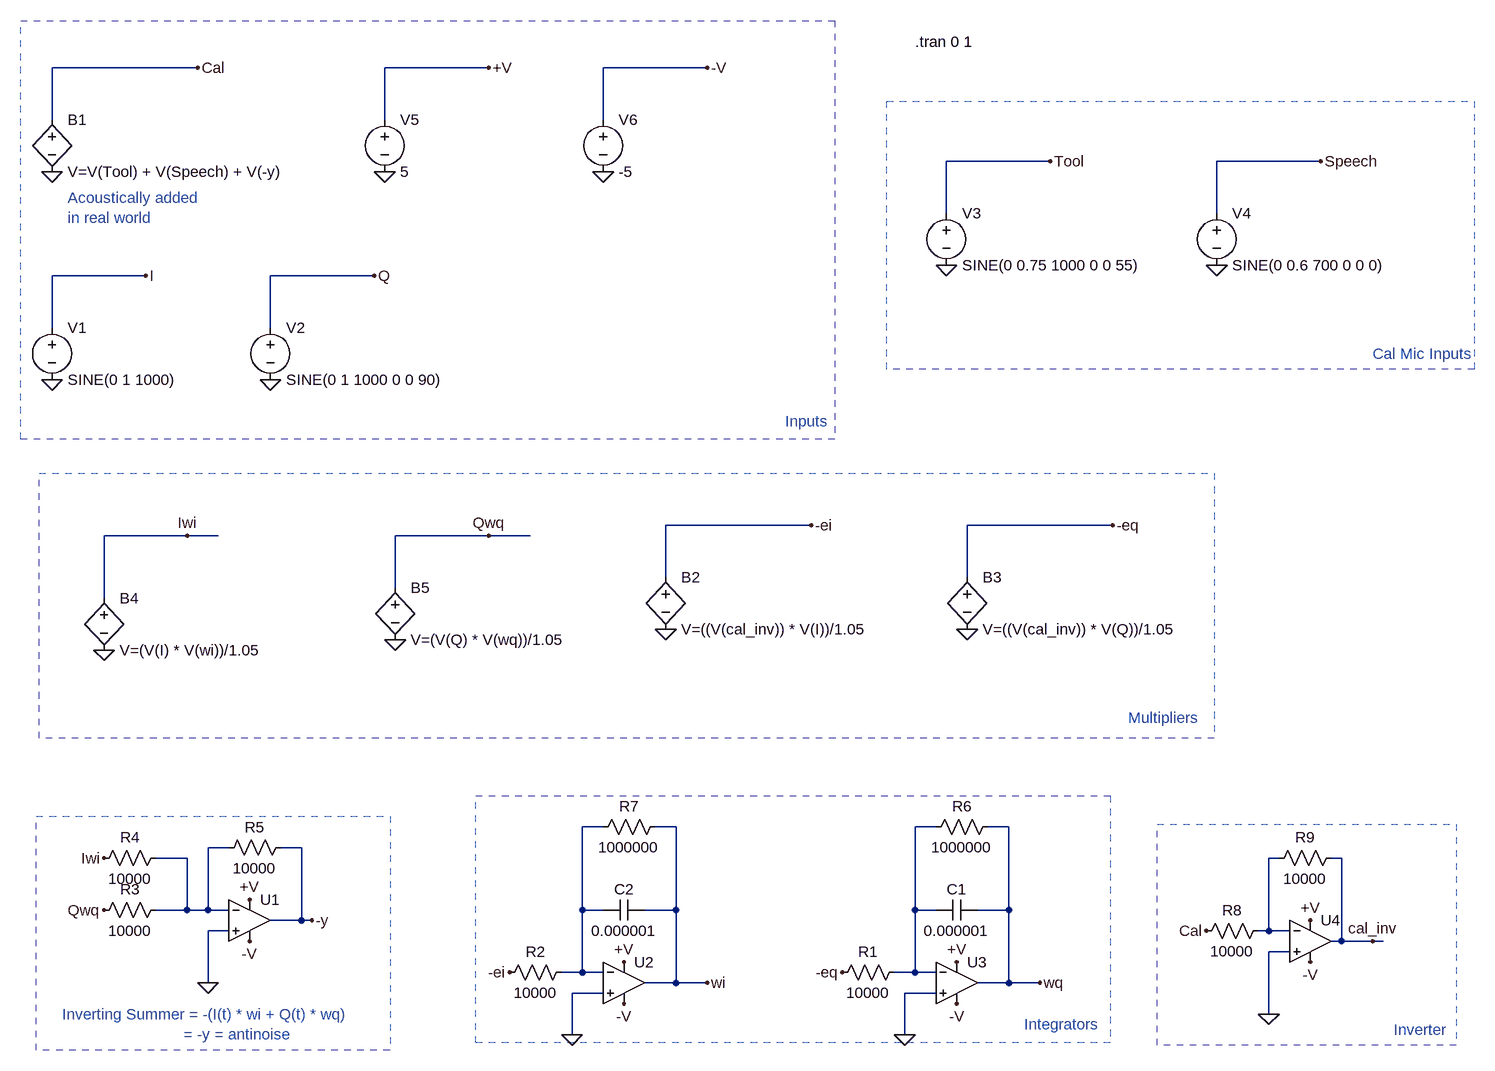
[diagram p0: schematic ancsim.asc]
ancsim.asc, the LTspice schematic file:
Version 4
SHEET 1 3376 1148
WIRE 624 -368 400 -368
WIRE 1072 -368 912 -368
WIRE 1408 -368 1248 -368
WIRE 400 -288 400 -368
WIRE 912 -288 912 -368
WIRE 1248 -288 1248 -368
WIRE 1936 -224 1776 -224
WIRE 2352 -224 2192 -224
WIRE 1776 -144 1776 -224
WIRE 2192 -144 2192 -224
WIRE 544 -48 400 -48
WIRE 896 -48 736 -48
WIRE 400 32 400 -48
WIRE 736 32 736 -48
WIRE 1568 336 1344 336
WIRE 2032 336 1808 336
WIRE 608 352 480 352
WIRE 656 352 608 352
WIRE 1072 352 928 352
WIRE 1136 352 1072 352
WIRE 1344 416 1344 336
WIRE 1808 416 1808 336
WIRE 928 432 928 352
WIRE 480 448 480 352
WIRE 1248 800 1216 800
WIRE 1360 800 1328 800
WIRE 1760 800 1728 800
WIRE 1872 800 1840 800
WIRE 672 832 640 832
WIRE 784 832 752 832
WIRE 608 848 560 848
WIRE 2288 848 2272 848
WIRE 2384 848 2368 848
WIRE 608 928 608 848
WIRE 608 928 560 928
WIRE 640 928 640 832
WIRE 640 928 608 928
WIRE 672 928 640 928
WIRE 1216 928 1216 800
WIRE 1248 928 1216 928
WIRE 1360 928 1360 800
WIRE 1360 928 1312 928
WIRE 1728 928 1728 800
WIRE 1760 928 1728 928
WIRE 1872 928 1872 800
WIRE 1872 928 1824 928
WIRE 784 944 784 832
WIRE 784 944 736 944
WIRE 800 944 784 944
WIRE 672 960 640 960
WIRE 2272 960 2272 848
WIRE 2272 960 2256 960
WIRE 2304 960 2272 960
WIRE 2384 976 2384 848
WIRE 2384 976 2368 976
WIRE 2432 976 2384 976
WIRE 2448 976 2432 976
WIRE 2304 992 2272 992
WIRE 1216 1024 1216 928
WIRE 1216 1024 1184 1024
WIRE 1248 1024 1216 1024
WIRE 1728 1024 1728 928
WIRE 1728 1024 1696 1024
WIRE 1760 1024 1728 1024
WIRE 640 1040 640 960
WIRE 1360 1040 1360 928
WIRE 1360 1040 1312 1040
WIRE 1408 1040 1360 1040
WIRE 1872 1040 1872 928
WIRE 1872 1040 1824 1040
WIRE 1920 1040 1872 1040
WIRE 1248 1056 1200 1056
WIRE 1760 1056 1712 1056
WIRE 2272 1088 2272 992
WIRE 1200 1120 1200 1056
WIRE 1712 1120 1712 1056
FLAG 400 112 0
FLAG 736 112 0
FLAG 1776 -64 0
FLAG 2192 -64 0
FLAG 544 -48 I
FLAG 896 -48 Q
FLAG 1936 -224 Tool
FLAG 2352 -224 Speech
FLAG 400 -208 0
FLAG 624 -368 Cal
FLAG 1344 496 0
FLAG 1808 496 0
FLAG 1568 336 -ei
FLAG 2032 336 -eq
FLAG 1712 1120 0
FLAG 1920 1040 wq
FLAG 1200 1120 0
FLAG 1408 1040 wi
FLAG 912 -208 0
FLAG 1072 -368 +V
FLAG 1248 -208 0
FLAG 1408 -368 -V
FLAG 704 912 +V
FLAG 1280 1008 +V
FLAG 1792 1008 +V
FLAG 1792 1072 -V
FLAG 1280 1072 -V
FLAG 704 976 -V
FLAG 480 528 0
FLAG 928 512 0
FLAG 608 352 Iwi
FLAG 1072 352 Qwq
FLAG 480 848 Iwi
FLAG 480 928 Qwq
FLAG 800 944 -y
FLAG 640 1040 0
FLAG 1104 1024 -ei
FLAG 1616 1024 -eq
FLAG 2272 1088 0
FLAG 2176 960 Cal
FLAG 2432 976 cal_inv
FLAG 2336 944 +V
FLAG 2336 1008 -V
SYMBOL voltage 400 16 R0
SYMATTR InstName V1
SYMATTR Value SINE(0 1 1000)
SYMBOL voltage 736 16 R0
SYMATTR InstName V2
SYMATTR Value SINE(0 1 1000 0 0 90)
SYMBOL voltage 1776 -160 R0
SYMATTR InstName V3
SYMATTR Value SINE(0 0.75 1000 0 0 55)
SYMBOL voltage 2192 -160 R0
SYMATTR InstName V4
SYMATTR Value SINE(0 0.6 700 0 0 0)
SYMBOL bv 400 -304 R0
SYMATTR InstName B1
SYMATTR Value V=V(Tool) + V(Speech) + V(-y)
SYMBOL OpAmps/UniversalOpAmp2 704 944 R0
SYMATTR InstName U1
SYMATTR Value2 Avol=1Meg GBW=10Meg Slew=20Meg
SYMBOL OpAmps/UniversalOpAmp2 1792 1040 R0
SYMATTR InstName U3
SYMBOL bv 1344 400 R0
SYMATTR InstName B2
SYMATTR Value V=((V(cal_inv)) * V(I))/1.05
SYMBOL bv 1808 400 R0
SYMATTR InstName B3
SYMATTR Value V=((V(cal_inv)) * V(Q))/1.05
SYMBOL Res 1712 1008 R90
WINDOW 0 0 56 VBottom 2
WINDOW 3 32 56 VTop 2
SYMATTR InstName R1
SYMATTR Value 10000
SYMBOL Cap 1824 912 R90
WINDOW 0 0 32 VBottom 2
WINDOW 3 32 32 VTop 2
SYMATTR InstName C1
SYMATTR Value 0.000001
SYMBOL OpAmps/UniversalOpAmp2 1280 1040 R0
SYMATTR InstName U2
SYMBOL Res 1200 1008 R90
WINDOW 0 0 56 VBottom 2
WINDOW 3 32 56 VTop 2
SYMATTR InstName R2
SYMATTR Value 10000
SYMBOL Cap 1312 912 R90
WINDOW 0 0 32 VBottom 2
WINDOW 3 32 32 VTop 2
SYMATTR InstName C2
SYMATTR Value 0.000001
SYMBOL voltage 912 -304 R0
SYMATTR InstName V5
SYMATTR Value 5
SYMBOL voltage 1248 -304 R0
SYMATTR InstName V6
SYMATTR Value -5
SYMBOL bv 480 432 R0
SYMATTR InstName B4
SYMATTR Value V=(V(I) * V(wi))/1.05
SYMBOL bv 928 416 R0
SYMATTR InstName B5
SYMATTR Value V=(V(Q) * V(wq))/1.05
SYMBOL Res 576 912 R90
WINDOW 0 0 56 VBottom 2
WINDOW 3 32 56 VTop 2
SYMATTR InstName R3
SYMATTR Value 10000
SYMBOL Res 576 832 R90
WINDOW 0 0 56 VBottom 2
WINDOW 3 32 56 VTop 2
SYMATTR InstName R4
SYMATTR Value 10000
SYMBOL Res 768 816 R90
WINDOW 0 0 56 VBottom 2
WINDOW 3 32 56 VTop 2
SYMATTR InstName R5
SYMATTR Value 10000
SYMBOL Res 1856 784 R90
WINDOW 0 0 56 VBottom 2
WINDOW 3 32 56 VTop 2
SYMATTR InstName R6
SYMATTR Value 1000000
SYMBOL Res 1344 784 R90
WINDOW 0 0 56 VBottom 2
WINDOW 3 32 56 VTop 2
SYMATTR InstName R7
SYMATTR Value 1000000
SYMBOL OpAmps/UniversalOpAmp2 2336 976 R0
SYMATTR InstName U4
SYMBOL Res 2272 944 R90
WINDOW 0 0 56 VBottom 2
WINDOW 3 32 56 VTop 2
SYMATTR InstName R8
SYMATTR Value 10000
SYMBOL Res 2384 832 R90
WINDOW 0 0 56 VBottom 2
WINDOW 3 32 56 VTop 2
SYMATTR InstName R9
SYMATTR Value 10000
TEXT 1728 -408 Left 2 !.tran 0 1
TEXT 2056 632 Left 2 ;Multipliers
TEXT 1896 1104 Left 2 ;Integrators
TEXT 1528 176 Left 2 ;Inputs
TEXT 2432 72 Left 2 ;Cal Mic Inputs
TEXT 416 1088 Left 2 ;Inverting Summer = -(I(t) * wi + Q(t) * wq)\n                           = -y = antinoise
TEXT 424 -168 Left 2 ;Acoustically added \nin real world
TEXT 2464 1112 Left 2 ;Inverter
RECTANGLE Normal 380 256 2188 664 2
RECTANGLE Normal 1052 752 2028 1132 2
RECTANGLE Normal 376 784 920 1144 2
RECTANGLE Normal 352 -440 1604 204 2
RECTANGLE Normal 1684 -316 2588 96 2
RECTANGLE Normal 2100 796 2560 1136 2

The netlist it stands for:
* ancsim.asc
V1 I 0 SINE(0 1 1000)
V2 Q 0 SINE(0 1 1000 0 0 90)
V3 Tool 0 SINE(0 0.75 1000 0 0 55)
V4 Speech 0 SINE(0 0.6 700 0 0 0)
B1 Cal 0 V=V(Tool) + V(Speech) + V(-y)
XU1 0 N003 +V -V -y level2 Avol=1Meg GBW=10Meg Slew=20Meg Ilimit=25m Rail=0 Vos=0 En=0 Enk=0 In=0 Ink=0 Rin=500Meg  ; pins In+ In- V+ V- OUT
XU3 0 N002 +V -V wq level2 Avol=1Meg GBW=10Meg Slew=10Meg Ilimit=25m Rail=0 Vos=0 En=0 Enk=0 In=0 Ink=0 Rin=500Meg  ; pins In+ In- V+ V- OUT
B2 -ei 0 V=((V(cal_inv)) * V(I))/1.05
B3 -eq 0 V=((V(cal_inv)) * V(Q))/1.05
R1 N002 -eq 10000
C1 wq N002 0.000001
XU2 0 N001 +V -V wi level2 Avol=1Meg GBW=10Meg Slew=10Meg Ilimit=25m Rail=0 Vos=0 En=0 Enk=0 In=0 Ink=0 Rin=500Meg  ; pins In+ In- V+ V- OUT
R2 N001 -ei 10000
C2 wi N001 0.000001
V5 +V 0 5
V6 -V 0 -5
B4 Iwi 0 V=(V(I) * V(wi))/1.05
B5 Qwq 0 V=(V(Q) * V(wq))/1.05
R3 N003 Qwq 10000
R4 N003 Iwi 10000
R5 -y N003 10000
R6 wq N002 1000000
R7 wi N001 1000000
XU4 0 N004 +V -V cal_inv level2 Avol=1Meg GBW=10Meg Slew=10Meg Ilimit=25m Rail=0 Vos=0 En=0 Enk=0 In=0 Ink=0 Rin=500Meg  ; pins In+ In- V+ V- OUT
R8 N004 Cal 10000
R9 cal_inv N004 10000
.tran 0 1
* Multipliers
* Integrators
* Inputs
* Cal Mic Inputs
* Inverting Summer = -(I(t) * wi + Q(t) * wq)
*                            = -y = antinoise
* Acoustically added
* in real world
* Inverter
.lib UniversalOpAmp2.lib
.backanno
.end